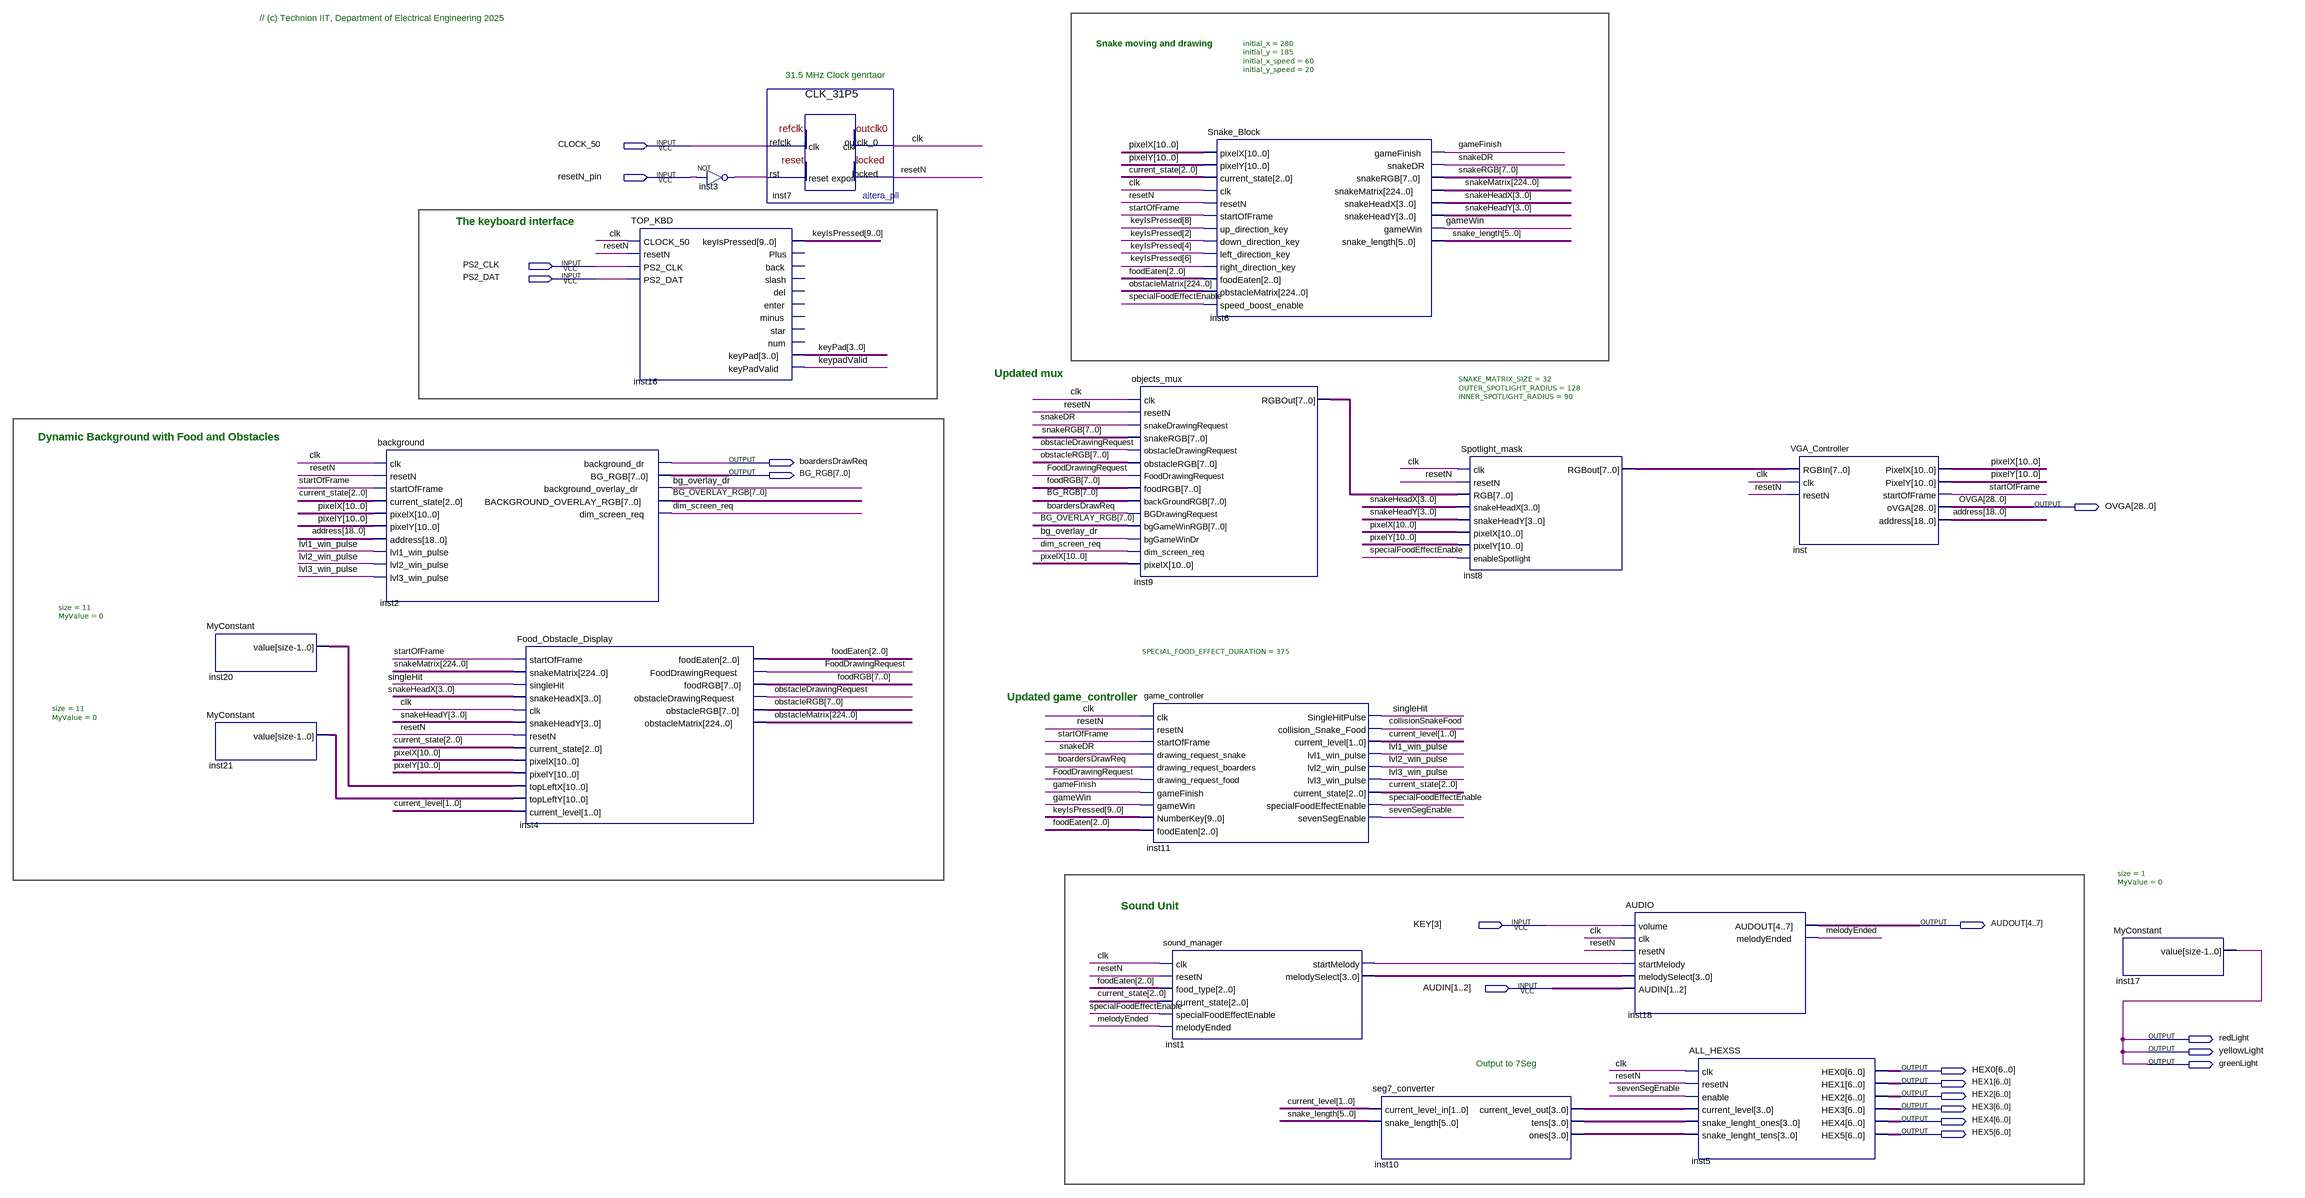
[diagram p0: schematic sheet]
// Quartus schematic TOP_VGA_DEMO.bdf as structural Verilog: 17 symbols, 19 pins
module TOP_VGA_DEMO (
  input  CLOCK_50,
  input  resetN_pin,
  input  PS2_CLK,
  input  PS2_DAT,
  input  [3:3] KEY,
  input  [1:2] AUDIN,
  output boardersDrawReq,
  output [7:0] BG_RGB,
  output [28:0] OVGA,
  output [4:7] AUDOUT,
  output redLight,
  output yellowLight,
  output greenLight,
  output [6:0] HEX0,
  output [6:0] HEX1,
  output [6:0] HEX2,
  output [6:0] HEX3,
  output [6:0] HEX4,
  output [6:0] HEX5
);

  wire bg_overlay_dr, clk, collisionSnakeFood, dim_screen_req, FoodDrawingRequest, gameFinish, gameWin,
       inst1_startmelody, inst3_out, keypadValid, lvl1_win_pulse, lvl2_win_pulse, lvl3_win_pulse,
       melodyEnded, obstacleDrawingRequest, resetN, sevenSegEnable, singleHit, snakeDR,
       specialFoodEffectEnable, startOfFrame;
  wire [1:0] current_level;
  wire [2:0] current_state, foodEaten;
  wire [3:0] inst1_melodyselect, inst10_current_level_out, inst10_ones, inst10_tens, keyPad, snakeHeadX,
       snakeHeadY;
  wire [5:0] snake_length;
  wire [7:0] BG_OVERLAY_RGB, foodRGB, inst8_rgbout, inst9_rgbout, obstacleRGB, snakeRGB;
  wire [9:0] keyIsPressed;
  wire [10:0] inst20_value, inst21_value, pixelX, pixelY;
  wire [18:0] address;
  wire [224:0] obstacleMatrix, snakeMatrix;

  MyConstant #(.size(11), .MyValue(0)) inst20 (.value(inst20_value));
  MyConstant #(.size(11), .MyValue(0)) inst21 (.value(inst21_value));
  background inst2 (
    .clk(clk), .resetN(resetN), .startOfFrame(startOfFrame), .current_state(current_state), .pixelX(pixelX),
    .pixelY(pixelY), .address(address), .lvl1_win_pulse(lvl1_win_pulse), .lvl2_win_pulse(lvl2_win_pulse),
    .lvl3_win_pulse(lvl3_win_pulse), .background_dr(boardersDrawReq), .BG_RGB(BG_RGB),
    .background_overlay_dr(bg_overlay_dr), .BACKGROUND_OVERLAY_RGB(BG_OVERLAY_RGB),
    .dim_screen_req(dim_screen_req));
  Food_Obstacle_Display inst4 (
    .startOfFrame(startOfFrame), .snakeMatrix(snakeMatrix), .singleHit(singleHit), .snakeHeadX(snakeHeadX),
    .clk(clk), .snakeHeadY(snakeHeadY), .resetN(resetN), .current_state(current_state), .pixelX(pixelX),
    .pixelY(pixelY), .topLeftX(inst20_value), .topLeftY(inst21_value), .current_level(current_level),
    .foodEaten(foodEaten), .FoodDrawingRequest(FoodDrawingRequest), .foodRGB(foodRGB),
    .obstacleDrawingRequest(obstacleDrawingRequest), .obstacleRGB(obstacleRGB),
    .obstacleMatrix(obstacleMatrix));
  TOP_KBD inst16 (
    .CLOCK_50(clk), .resetN(resetN), .PS2_CLK(PS2_CLK), .PS2_DAT(PS2_DAT), .keyIsPressed(keyIsPressed),
    .keyPad(keyPad), .keyPadValid(keypadValid));  // open: Plus, back, slash, del, enter, minus, star, num
  not inst3 (inst3_out, resetN_pin);
  CLK_31P5 inst7 (.refclk(CLOCK_50), .rst(inst3_out), .outclk_0(clk), .locked(resetN));
  objects_mux inst9 (
    .clk(clk), .resetN(resetN), .snakeDrawingRequest(snakeDR), .snakeRGB(snakeRGB),
    .obstacleDrawingRequest(obstacleDrawingRequest), .obstacleRGB(obstacleRGB),
    .FoodDrawingRequest(FoodDrawingRequest), .foodRGB(foodRGB), .backGroundRGB(BG_RGB),
    .BGDrawingRequest(boardersDrawReq), .bgGameWinRGB(BG_OVERLAY_RGB), .bgGameWinDr(bg_overlay_dr),
    .dim_screen_req(dim_screen_req), .pixelX(pixelX), .RGBOut(inst9_rgbout));
  game_controller #(.SPECIAL_FOOD_EFFECT_DURATION(375)) inst11 (
    .clk(clk), .resetN(resetN), .startOfFrame(startOfFrame), .drawing_request_snake(snakeDR),
    .drawing_request_boarders(boardersDrawReq), .drawing_request_food(FoodDrawingRequest),
    .gameFinish(gameFinish), .gameWin(gameWin), .NumberKey(keyIsPressed), .foodEaten(foodEaten),
    .SingleHitPulse(singleHit), .collision_Snake_Food(collisionSnakeFood), .current_level(current_level),
    .lvl1_win_pulse(lvl1_win_pulse), .lvl2_win_pulse(lvl2_win_pulse), .lvl3_win_pulse(lvl3_win_pulse),
    .current_state(current_state), .specialFoodEffectEnable(specialFoodEffectEnable),
    .sevenSegEnable(sevenSegEnable));
  sound_manager inst1 (
    .clk(clk), .resetN(resetN), .food_type(foodEaten), .current_state(current_state),
    .specialFoodEffectEnable(specialFoodEffectEnable), .melodyEnded(melodyEnded),
    .startMelody(inst1_startmelody), .melodySelect(inst1_melodyselect));
  Snake_Block #(.initial_x(280), .initial_y(185), .initial_x_speed(60), .initial_y_speed(20)) inst6 (
    .pixelX(pixelX), .pixelY(pixelY), .current_state(current_state), .clk(clk), .resetN(resetN),
    .startOfFrame(startOfFrame), .up_direction_key(keyIsPressed[8]), .down_direction_key(keyIsPressed[2]),
    .left_direction_key(keyIsPressed[4]), .right_direction_key(keyIsPressed[6]), .foodEaten(foodEaten),
    .obstacleMatrix(obstacleMatrix), .speed_boost_enable(specialFoodEffectEnable), .gameFinish(gameFinish),
    .snakeDR(snakeDR), .snakeRGB(snakeRGB), .snakeMatrix(snakeMatrix), .snakeHeadX(snakeHeadX),
    .snakeHeadY(snakeHeadY), .gameWin(gameWin), .snake_length(snake_length));
  seg7_converter inst10 (
    .current_level_in(current_level), .snake_length(snake_length),
    .current_level_out(inst10_current_level_out), .tens(inst10_tens), .ones(inst10_ones));
  Spotlight_mask #(.SNAKE_MATRIX_SIZE(32), .OUTER_SPOTLIGHT_RADIUS(128), .INNER_SPOTLIGHT_RADIUS(90)) inst8 (
    .clk(clk), .resetN(resetN), .RGB(inst9_rgbout), .snakeHeadX(snakeHeadX), .snakeHeadY(snakeHeadY),
    .pixelX(pixelX), .pixelY(pixelY), .enableSpotlight(specialFoodEffectEnable), .RGBout(inst8_rgbout));
  AUDIO inst18 (
    .volume(KEY[3]), .clk(clk), .resetN(resetN), .startMelody(inst1_startmelody),
    .melodySelect(inst1_melodyselect), .AUDIN(AUDIN), .AUDOUT(AUDOUT), .melodyEnded(melodyEnded));
  ALL_HEXSS inst5 (
    .clk(clk), .resetN(resetN), .enable(sevenSegEnable), .current_level(inst10_current_level_out),
    .snake_lenght_ones(inst10_tens), .snake_lenght_tens(inst10_ones), .HEX0(HEX0), .HEX1(HEX1), .HEX2(HEX2),
    .HEX3(HEX3), .HEX4(HEX4), .HEX5(HEX5));
  VGA_Controller inst (
    .RGBIn(inst8_rgbout), .clk(clk), .resetN(resetN), .PixelX(pixelX), .PixelY(pixelY),
    .startOfFrame(startOfFrame), .oVGA(OVGA), .address(address));
  MyConstant #(.size(1), .MyValue(0)) inst17 (.value(greenLight));

  assign redLight = greenLight;
  assign yellowLight = greenLight;

  // Notes on the sheet:
  //   // (c) Technion IIT, Department of Electrical Engineering 2025
  //   Snake moving and drawing
  //   31.5 MHz Clock genrtaor
  //   The keyboard interface
  //   Updated mux
  //   Dynamic Background with Food and Obstacles
  //   Updated game_controller
  //   Sound Unit
  //   Output to 7Seg
endmodule
